# Altium schematic sheet TP_Integrador_Palomino_Villafane_Manuel_Cpu_R00.SchDoc
size A4; SheetNumber: 2; SheetTotal: 3
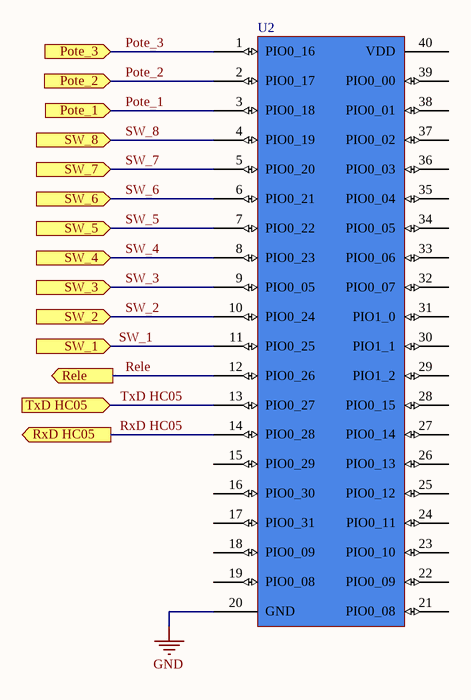
[diagram p0: TP_Integrador_Palomino_Villafane_Manuel_Cpu_R00.SchDoc]

## Parts
U2  Header F 1x20x.1"  x2  [LPC845_DIP40]  (value not drawn)

## Ports
Pote_1 (in, see TP_Integrador_Palomino_Villafane_Manuel_Blk_R00[2B], TP_Integrador_Palomino_Villafane_Manuel_Per_R00[4B]), Pote_2 (in, see TP_Integrador_Palomino_Villafane_Manuel_Blk_R00[2B], TP_Integrador_Palomino_Villafane_Manuel_Per_R00[4C]), Pote_3 (in, see TP_Integrador_Palomino_Villafane_Manuel_Blk_R00[2B], TP_Integrador_Palomino_Villafane_Manuel_Per_R00[4D]), Rele (out, see TP_Integrador_Palomino_Villafane_Manuel_Blk_R00[2B], TP_Integrador_Palomino_Villafane_Manuel_Per_R00[2A]), RxD HC05 (out, see TP_Integrador_Palomino_Villafane_Manuel_Blk_R00[2B], TP_Integrador_Palomino_Villafane_Manuel_Per_R00[4A]), SW_1 (in, see TP_Integrador_Palomino_Villafane_Manuel_Blk_R00[2B], TP_Integrador_Palomino_Villafane_Manuel_Per_R00[3C]), SW_2 (in, see TP_Integrador_Palomino_Villafane_Manuel_Blk_R00[2B], TP_Integrador_Palomino_Villafane_Manuel_Per_R00[2C]), SW_3 (in, see TP_Integrador_Palomino_Villafane_Manuel_Blk_R00[2C], TP_Integrador_Palomino_Villafane_Manuel_Per_R00[1C]), SW_4 (in, see TP_Integrador_Palomino_Villafane_Manuel_Blk_R00[2C], TP_Integrador_Palomino_Villafane_Manuel_Per_R00[1C]), SW_5 (in, see TP_Integrador_Palomino_Villafane_Manuel_Blk_R00[2C], TP_Integrador_Palomino_Villafane_Manuel_Per_R00[3C]), SW_6 (in, see TP_Integrador_Palomino_Villafane_Manuel_Blk_R00[2C], TP_Integrador_Palomino_Villafane_Manuel_Per_R00[2C]), SW_7 (in, see TP_Integrador_Palomino_Villafane_Manuel_Blk_R00[2C], TP_Integrador_Palomino_Villafane_Manuel_Per_R00[1C]), SW_8 (in, see TP_Integrador_Palomino_Villafane_Manuel_Blk_R00[2C], TP_Integrador_Palomino_Villafane_Manuel_Per_R00[1C]), TxD HC05 (in, see TP_Integrador_Palomino_Villafane_Manuel_Blk_R00[2B], TP_Integrador_Palomino_Villafane_Manuel_Per_R00[4A])

## Nets
GND: U2.20(GND)
Pote_1: U2.3(PIO0_18) ; port Pote_1
Pote_2: U2.2(PIO0_17) ; port Pote_2
Pote_3: U2.1(PIO0_16) ; port Pote_3
Rele: U2.12(PIO0_26) ; port Rele
RxD HC05: U2.14(PIO0_28) ; port RxD HC05
SW_1: U2.11(PIO0_25) ; port SW_1
SW_2: U2.10(PIO0_24) ; port SW_2
SW_3: U2.9(PIO0_05) ; port SW_3
SW_4: U2.8(PIO0_23) ; port SW_4
SW_5: U2.7(PIO0_22) ; port SW_5
SW_6: U2.6(PIO0_21) ; port SW_6
SW_7: U2.5(PIO0_20) ; port SW_7
SW_8: U2.4(PIO0_19) ; port SW_8
TxD HC05: U2.13(PIO0_27) ; port TxD HC05

Not connected (* = marked no-connect by the designer): U2 15(PIO0_29) 16(PIO0_30) 17(PIO0_31) 18(PIO0_09) 19(PIO0_08) 21(PIO0_08) 22(PIO0_09) 23(PIO0_10) 24(PIO0_11) 25(PIO0_12) 26(PIO0_13) 27(PIO0_14) 28(PIO0_15) 29(PIO1_2) 30(PIO1_1) 31(PIO1_0) 32(PIO0_07) 33(PIO0_06) 34(PIO0_05) 35(PIO0_04) 36(PIO0_03) 37(PIO0_02) 38(PIO0_01) 39(PIO0_00) 40(VDD)

## Library data of the parts
U2 = LPC845 Breakout board: Stick